# EAGLE design final-node (EAGLE 7.6.0)
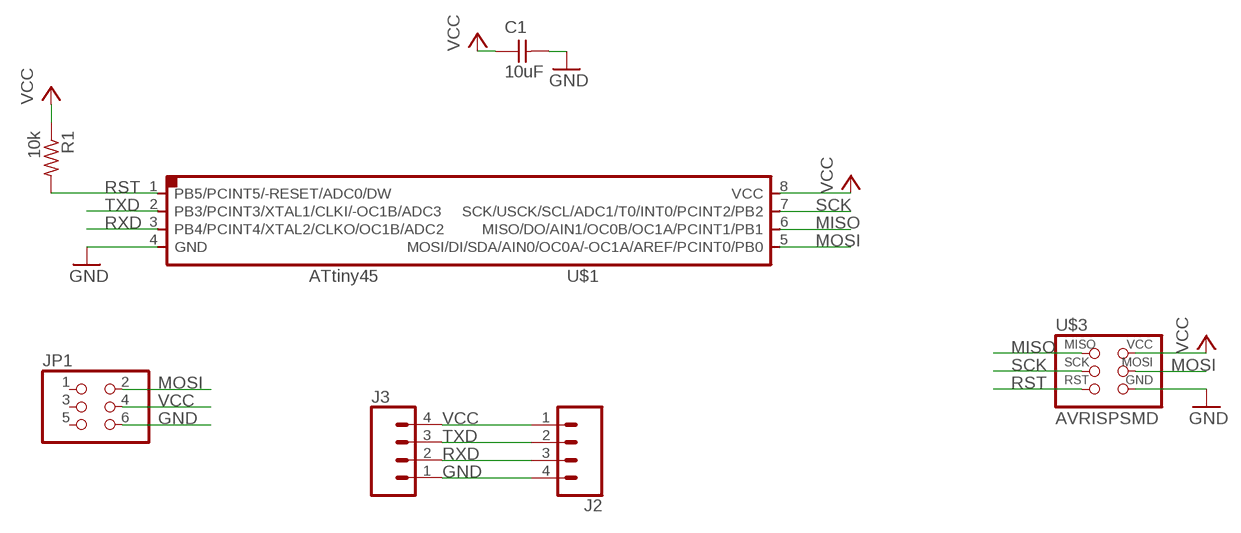
[diagram p0: schematic, sheet 1]

## Parts
C1  10uF  CAP-UNPOLARIZEDFAB  [C1206FAB]
J2  CONN_04SMD  [1X04_SMD_RA_MALE]
J3  CONN_04SMD  [1X04_SMD_RA_MALE]
JP1  PINHD-2X3-SMD  [2X03SMD]
R1  10k  RES-US1206FAB  [R1206FAB]
U$1  ATTINY45SI  [SOIC8]
U$3  AVRISPSMD  [2X03SMD]

## Nets
GND: C1.2 J2.4 J3.1 JP1.6 U$1.4(GND) U$3.6(GND)
MISO: U$1.6(MISO/DO/AIN1/OC0B/OC1A/PCINT1/PB1) U$3.1(MISO)
MOSI: JP1.2 U$1.5(MOSI/DI/SDA/AIN0/OC0A/-OC1A/AREF/PCINT0/PB0) U$3.4(MOSI)
RST: R1.2 U$1.1(PB5/PCINT5/-RESET/ADC0/DW) U$3.5(RST)
RXD: J2.3 J3.2 U$1.3(PB4/PCINT4/XTAL2/CLKO/OC1B/ADC2)
SCK: U$1.7(SCK/USCK/SCL/ADC1/T0/INT0/PCINT2/PB2) U$3.3(SCK)
TXD: J2.2 J3.3 U$1.2(PB3/PCINT3/XTAL1/CLKI/-OC1B/ADC3)
VCC: C1.1 J2.1 J3.4 JP1.4 R1.1 U$1.8(VCC) U$3.2(VCC)
Unconnected: JP1.1 JP1.3 JP1.5

## Library data of the parts
C1 = fab:CAP-UNPOLARIZED
J2 J3 = SparkFun-Connectors:CONN_04: Multi connection point. Often used as Generic Header-pin footprint for 0.1 inch spaced/style header connections On any of the 0.1 inch spaced packages, you can populate with these: Break Away Headers - Straight <https://www.sparkfun.com/products/116> (PRT-00116) Break Away Male Headers - Right Angle <https://www.sparkfun.com/products/553> (PRT-00553) Female Headers <https://www.sparkfun.com/products/115> (PRT-00115) Break Away Headers - Machine Pin <https://www.sparkfun.com/products/117> (PRT-00117) Break Away Female Headers - Swiss Machine Pin <https://www.sparkfun.com/products/743> (PRT-00743) For SCREWTERMINALS and SPRING TERMINALS visit here: Screw Terimnals on SparkFun.com <https://www.sparkfun.com/search/results?term=Screw+Terminals> (5mm/3.5mm/2.54mm spacing) This device is also useful as a general connection point to wire up your design to another part of your project. Our various solder wires solder well into these plated through hole pads. Hook-Up Wire - Assortment (Stranded, 22 AWG) <https://www.sparkfun.com/products/11375> (PRT-11375) Hook-Up Wire - Assortment (Solid Core, 22 AWG) <https://www.sparkfun.com/products/11367> (PRT-11367) View the entire wire category on our website here <https://www.sparkfun.com/categories/141> Special notes: Molex polarized connector foot print use with SKU : PRT-08231 with associated crimp pins and housings. 1MM SMD Version SKU: PRT-10208; PROD_ID: CONN-09140; SF_ID: PRT-12638
JP1 = fab:PINHD-2X3-SMD: PIN HEADER
R1 = fab:RES-US: Resistor (US Symbol) Variants with postfix FAB are widened to allow the routing of internal traces
U$1 = fab:ATTINY45
U$3 = fab:AVRISP

## Net classes
0 default: width 0.4 mm, clearance 0.3 mm

## Board
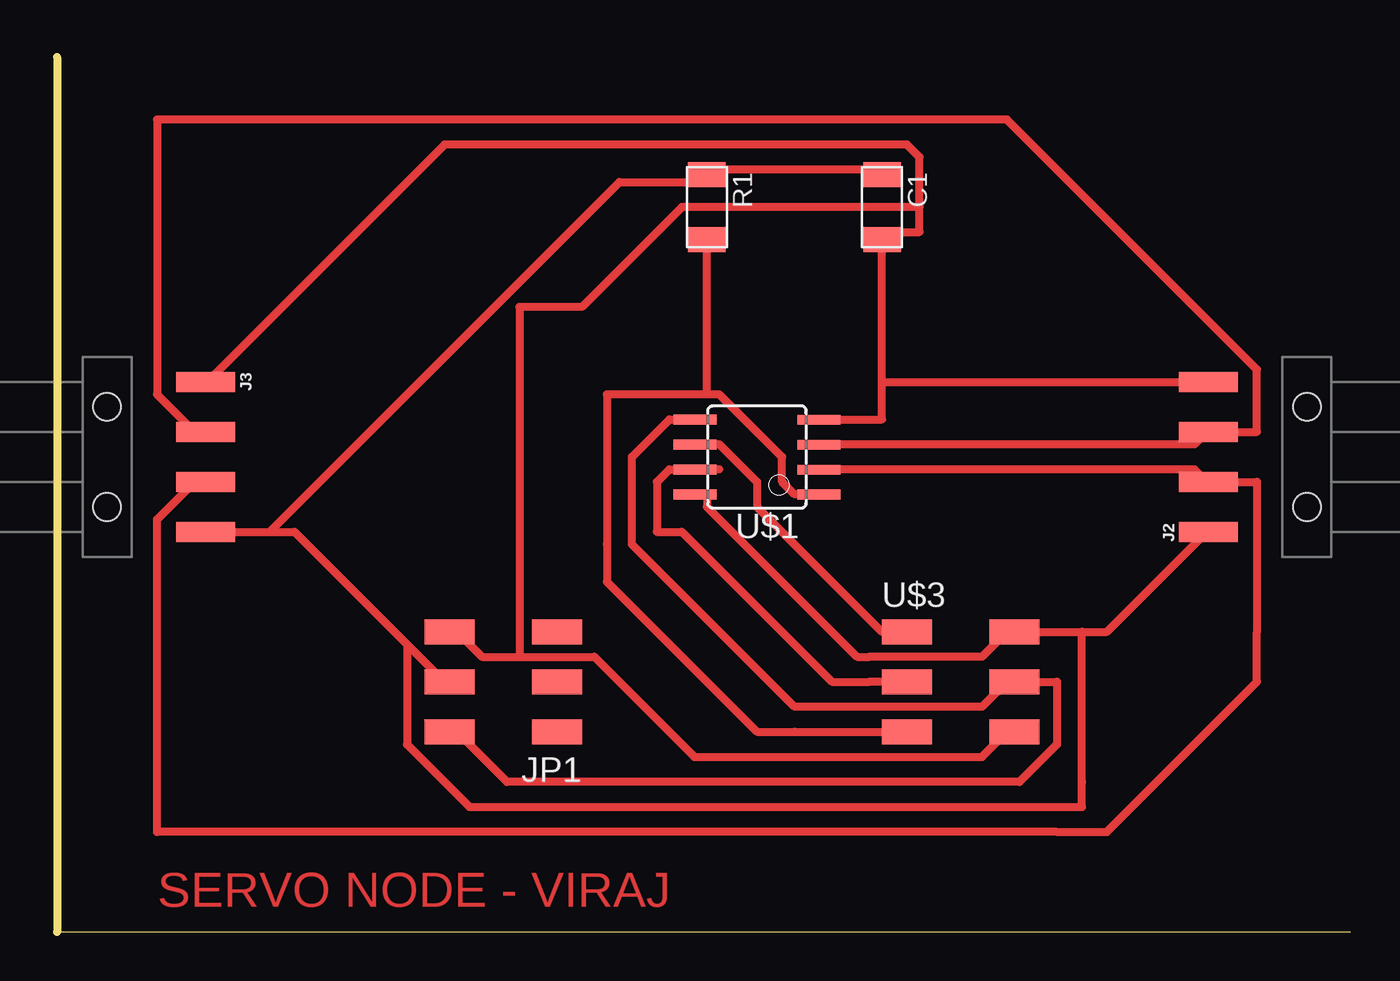
[diagram p1: board, top side]

Size 65.71 x 44.45 mm. Coordinates in mm from the lower left corner, seen from the top.
Outline: 0,0 65.71,0
Outline: 0,44.44 0,0
Outline: 0,44.45 0,0
Copper layers (1*16): Top 0.035mm / dielectric 1.5mm / Bottom 0.035mm
Design rules "fab": minimum track width 0.3mm, minimum drill 32mil, track to track 0.315mm, track to pad 0.315mm, pad to pad 0.315mm, via to via 0.315mm, smd to smd 0.315mm, copper to edge 40mil, drill to drill 16mil, minimum pad ring 10mil, minimum via ring 8mil, stop-mask expansion 4mil, vias tented up to drill 0mil, thermal gap 10mil

### Footprints (pad centres in the part's own frame; a part is rotated, then mirrored left to right if it is on the bottom)
C1206FAB = smd 1.27 x 1.905: 1 -1.651,0; 2 1.651,0
1X04_SMD_RA_MALE = smd 1 x 3: 1 -3.81,5; 2 -1.27,5; 3 1.27,5; 4 3.81,5 | hole 1.4: -2.54,0; 2.54,0
2X03SMD = smd 2.54 x 1.27: 1 -2.54,2.54; 2 2.92,2.54; 3 -2.54,0; 4 2.92,0; 5 -2.54,-2.54; 6 2.92,-2.54
R1206FAB = smd 1.27 x 1.905: 1 -1.651,0; 2 1.651,0
SOIC8 = smd 0.5 x 2.2: 1 -1.905,-3.154; 2 -0.645,-3.154; 3 0.625,-3.154; 4 1.895,-3.154; 5 1.905,3.154; 6 0.635,3.154; 7 -0.635,3.154; 8 -1.905,3.154

### Placement (x,y rotation side)
C1  41.91,36.83 270 top
J2  63.5,24.13 90 top
J3  2.54,24.13 270 top
JP1  22.86,12.7 180 top
R1  33.02,36.83 270 top
U$1  35.56,24.13 90 top
U$3  45.72,12.7 0 top

### Tracks (layer width: path | path; a pad name or v marks a point on that pad's centre or on a via)
GND
  Top 0.4: 23.49,13.97 21.59,13.97 20.32,15.24 JP1.6 | 23.49,13.97 27.3,13.97 32.38,8.89 46.99,8.89 48.26,10.16 U$3.6 | 41.91,27.94 41.91,26.04 38.73,26.04 U$1.4 | 41.91,27.94 C1.2 41.91,35.56 43.81,35.56 43.81,36.83 | 43.81,36.83 43.81,39.37 43.18,40 19.68,40 7.62,27.94 J3.1 | 41.91,27.94 J2.4 | 23.49,13.97 23.49,31.75 26.67,31.75 31.75,36.83 43.81,36.83
MISO
  Top 0.4: 33.66,24.77 U$1.6
  Top 0.406: 33.66,24.77 35.56,22.86 35.56,21.59 41.91,15.24 U$3.1
MOSI
  Top 0.4: U$1.5 31.12,26.04 29.21,24.13 29.21,19.68 37.46,11.43 46.99,11.43 48.26,12.7 U$3.4 50.8,12.7 50.8,9.53 48.89,7.62 22.86,7.62 20.32,10.16 JP1.2
RST
  Top 0.4: 33.02,27.3 R1.2 | 33.02,27.3 33.66,27.3 36.83,24.13 36.83,22.86 37.46,22.23 U$1.1 | 37.46,10.16 U$3.5 | 27.94,19.68 27.94,27.3 33.02,27.3
  Top 0.406: 27.94,19.68 27.94,17.78 35.56,10.16 37.46,10.16
RXD
  Top 0.4: U$1.3 38.73,24.77 57.78,24.77 58.42,25.4 J2.3 60.96,25.4 60.96,28.57 48.26,41.27 5.08,41.27 5.08,27.3 6.98,25.4 J3.2
S$1
  Top 0.406: 0,44.45 0,27.94
SCK
  Top 0.4: 33.66,23.5 U$1.7 31.12,23.5 30.48,22.86 | U$3.3 41.27,12.7
  Top 0.406: 30.48,22.86 30.48,20.32 31.75,20.32 39.37,12.7 41.27,12.7
TXD
  Top 0.4: U$1.2 38.73,23.5 57.78,23.5 58.42,22.86 J2.2 60.96,22.86 60.96,15.24 | 50.8,5.08 5.08,5.08 5.08,20.96 6.98,22.86 J3.3
  Top 0.406: 50.8,5.08 53.34,5.08 60.96,12.7 60.96,15.24
VCC
  Top 0.4: 41.27,13.97 46.99,13.97 48.26,15.24 U$3.2 52.07,15.24 | 33.02,22.23 U$1.8 | 52.07,15.24 53.34,15.24 58.42,20.32 J2.1 | C1.1 41.91,38.73 33.02,38.73 R1.1 33.02,38.1 28.58,38.1 10.79,20.32 | 17.78,14.61 12.06,20.32 10.79,20.32 | 17.78,14.61 19.68,12.7 JP1.4 | J3.4 10.79,20.32 | 52.07,7.62 52.07,15.24 | 48.89,6.35 20.95,6.35 17.78,9.53 17.78,14.61
  Top 0.406: 48.89,6.35 52.07,6.35 52.07,7.62 | 33.02,22.23 33.02,21.59 40.64,13.97 41.27,13.97

### Text on the board
Top: SERVO NODE - VIRAJ